# Altium schematic sheet 1_ZynTra-Power.SchDoc
size 381 x 355 mm; DocumentNumber: 1; SheetNumber: 1; SheetTotal: 10
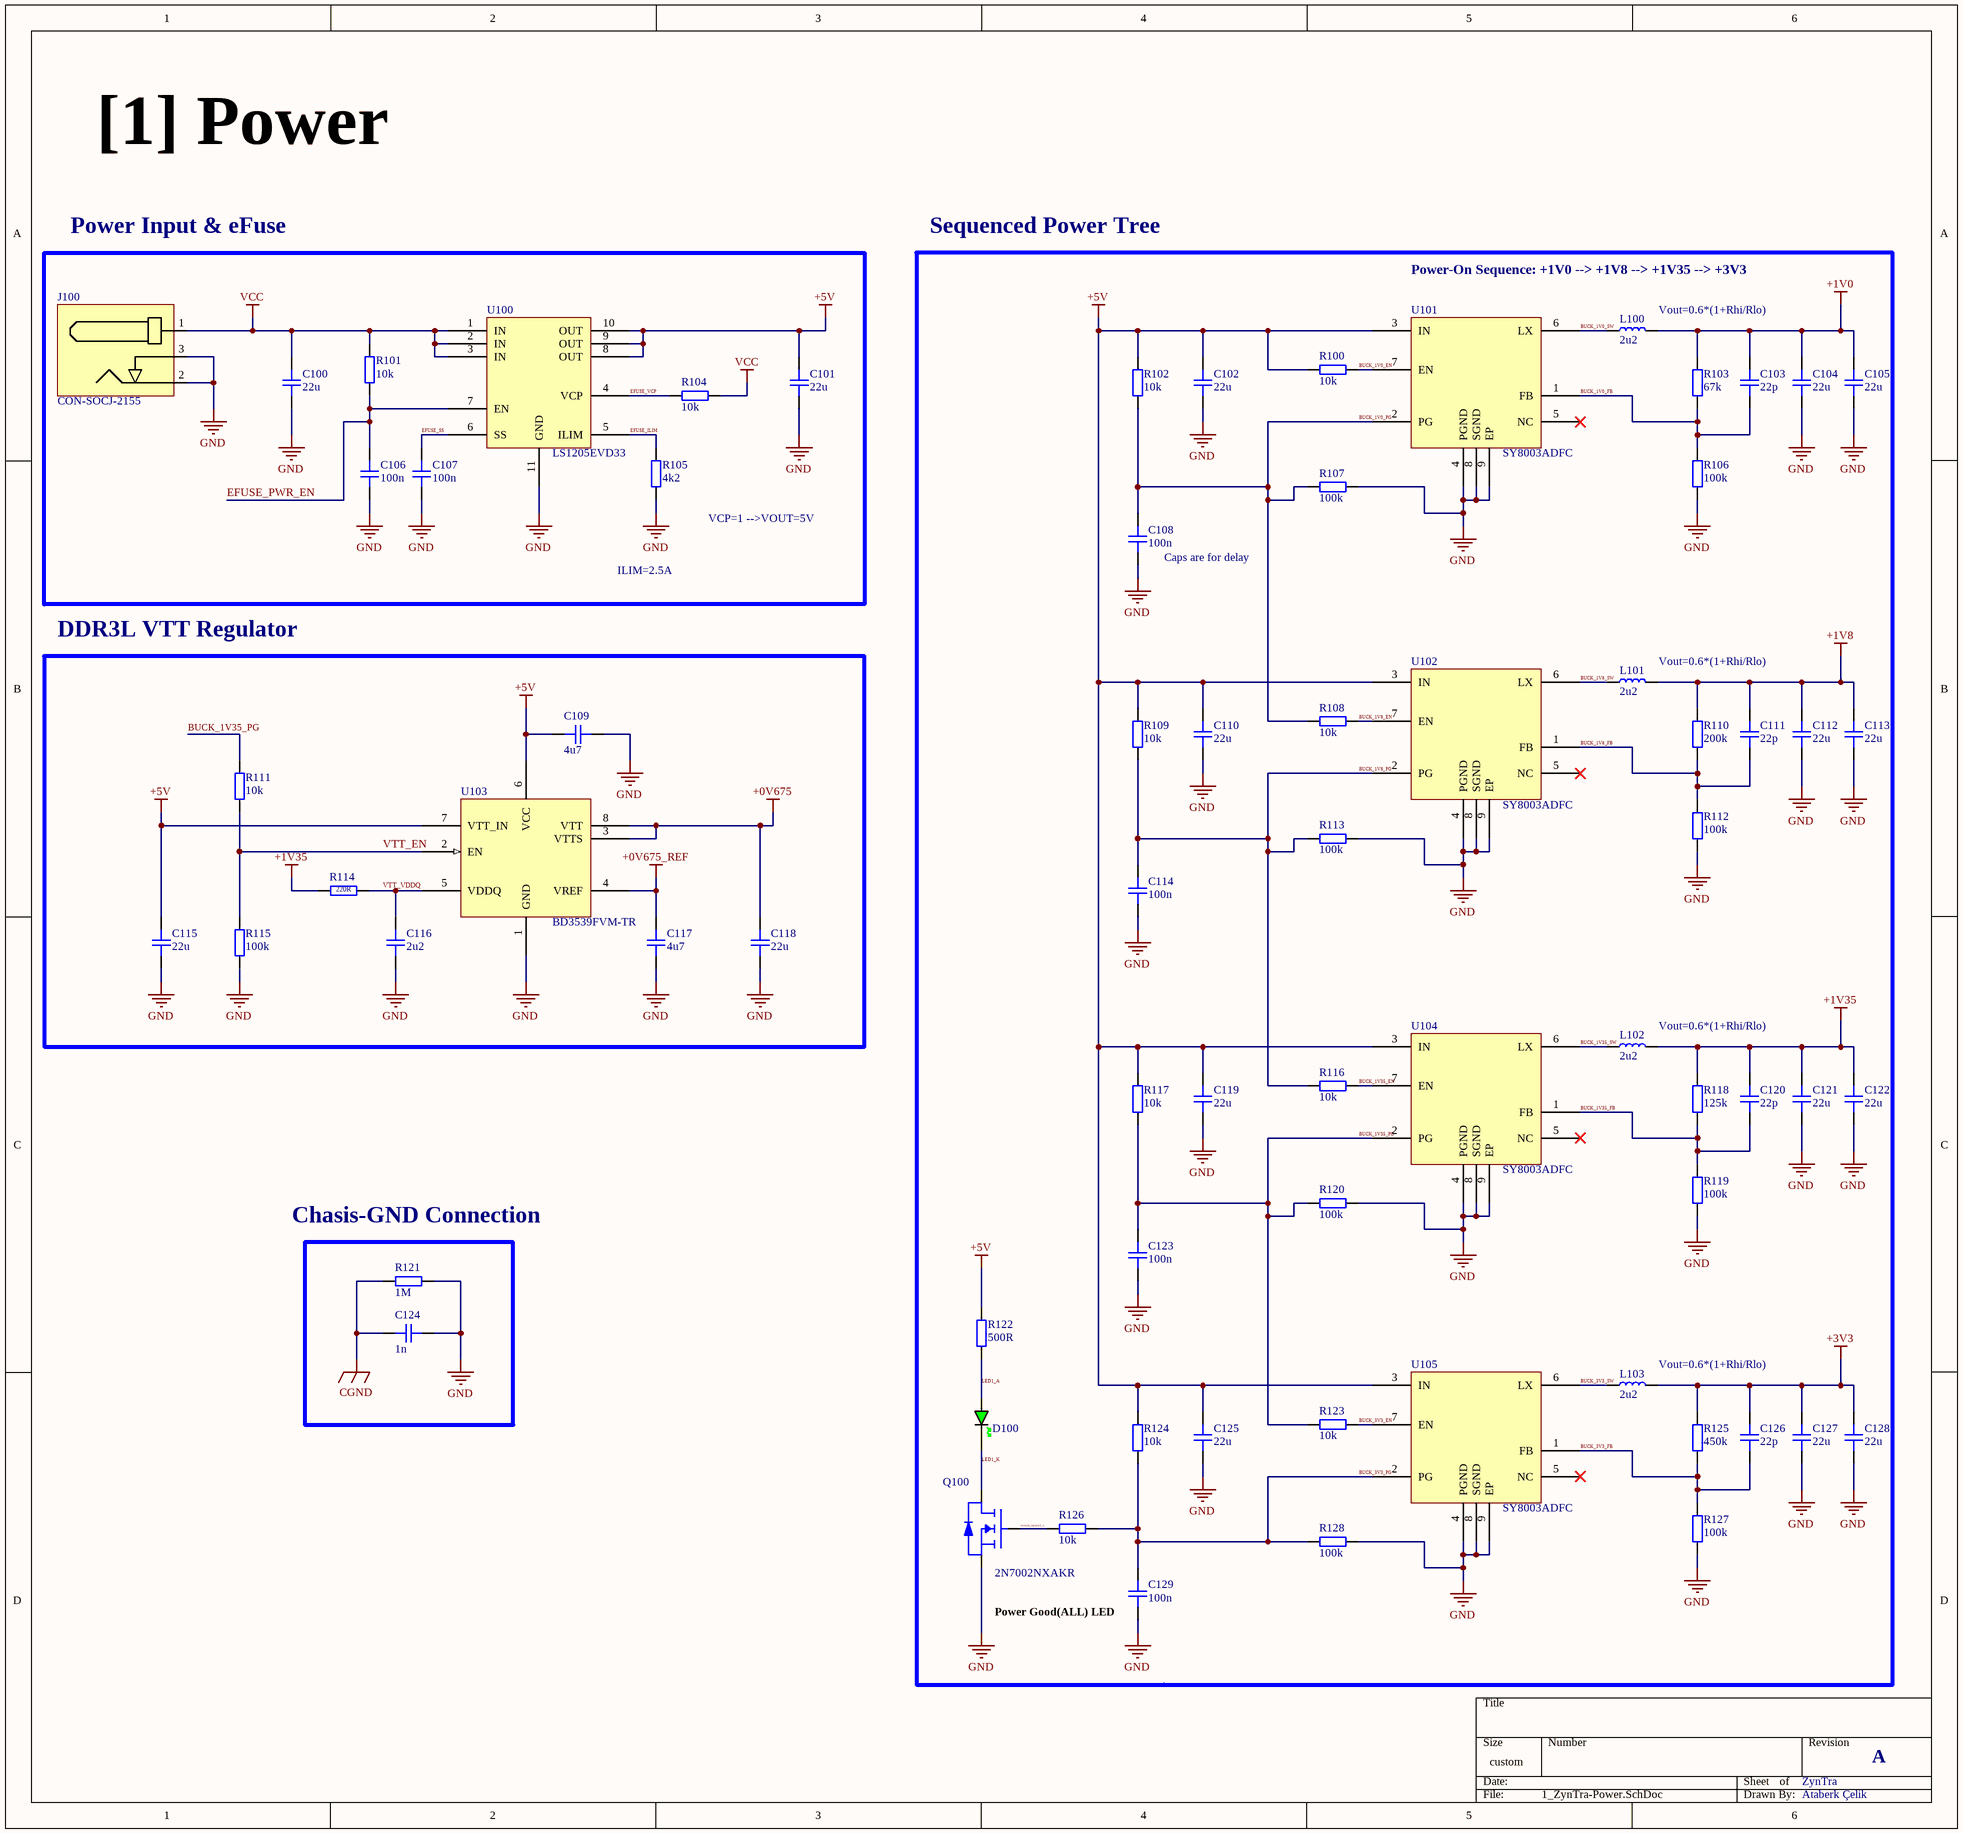
[diagram p0: 1_ZynTra-Power.SchDoc]

## Parts
C100  22u  [CAP_1206]
C101  22u  [CAP_1206]
C102  22u  [CAP_1206]
C103  22p  [CAP_0201]
C104  22u  [CAP_1206]
C105  22u  [CAP_1206]
C106  100n  [CAP_0402]
C107  100n  [CAP_0402]
C108  100n  [CAP_0402]
C109  4u7  [CAP_0402]
C110  22u  [CAP_1206]
C111  22p  [CAP_0201]
C112  22u  [CAP_1206]
C113  22u  [CAP_1206]
C114  100n  [CAP_0402]
C115  22u  [CAP_1206]
C116  2u2  [CAP_0402]
C117  4u7  [CAP_0402]
C118  22u  [CAP_1206]
C119  22u  [CAP_1206]
C120  22p  [CAP_0201]
C121  22u  [CAP_1206]
C122  22u  [CAP_1206]
C123  100n  [CAP_0402]
C124  1n  [CAP_1206]
C125  22u  [CAP_1206]
C126  22p  [CAP_0201]
C127  22u  [CAP_1206]
C128  22u  [CAP_1206]
C129  100n  [CAP_0402]
D100  GREEN  [LED_0603_GREEN]  (value not drawn)
J100  CON-SOCJ-2155  [CON-SOCJ-2155]
L100  2u2  [SRP0415]
L101  2u2  [SRP0415]
L102  2u2  [SRP0415]
L103  2u2  [SRP0415]
Q100  2N7002NXAKR  [SSM3J338R,LF-SOT23-F]
R100  10k  [RES_0402]
R101  10k  [RES_0402]
R102  10k  [RES_0402]
R103  67k  [RES_0402]
R104  10k  [RES_0402]
R105  4k2  [RES_0402]
R106  100k  [RES_0402]
R107  100k  [RES_0402]
R108  10k  [RES_0402]
R109  10k  [RES_0402]
R110  200k  [RES_0402]
R111  10k  [RES_0402]
R112  100k  [RES_0402]
R113  100k  [RES_0402]
R114  220R  [RES_0402]
R115  100k  [RES_0402]
R116  10k  [RES_0402]
R117  10k  [RES_0402]
R118  125k  [RES_0402]
R119  100k  [RES_0402]
R120  100k  [RES_0402]
R121  1M  [RES_1206]
R122  500R  [RES_0402]
R123  10k  [RES_0402]
R124  10k  [RES_0402]
R125  450k  [RES_0402]
R126  10k  [RES_0402]
R127  100k  [RES_0402]
R128  100k  [RES_0402]
U100  LS1205EVD33  [DFN3x3_10L]
U101  SY8003ADFC  [DFN2x2-8]
U102  SY8003ADFC  [DFN2x2-8]
U103  BD3539FVM-TR  [MSOP-8, 4x2.9mm]
U104  SY8003ADFC  [DFN2x2-8]
U105  SY8003ADFC  [DFN2x2-8]

## Blocks framed on the sheet
Power Input & eFuse: C100 C101 C106 C107 J100 R101 R104 R105 U100
Sequenced Power Tree: C102-C105 C108 C110-C114 C119-C123 C125-C129 D100 L100-L103 Q100 R100 R102 R103 R106-R110 R112 R113 R116-R120 R122-R128 U101 U102 U104 U105
DDR3L VTT Regulator: C109 C115-C118 R111 R114 R115 U103

## Nets
+0V675: C118.2 U103.3(VTTS) U103.8(VTT)
+0V675_REF: C117.2 U103.4(VREF)
+1V0: C103.2 C104.2 C105.2 L100.2 R103.1
+1V8: C111.2 C112.2 C113.2 L101.2 R110.1
+1V35: C120.2 C121.2 C122.2 L102.2 R114.2 R118.1
+3V3: C126.2 C127.2 C128.2 L103.2 R125.1
+5V: C101.2 C102.2 C109.2 C110.2 C115.2 C119.2 C125.2 R100.2 R102.1 R109.1 R117.1 R122.1 R124.1 U100.8(OUT) U100.9(OUT) U100.10(OUT) U101.3(IN) U102.3(IN) U103.6(VCC) U103.7(VTT_IN) U104.3(IN) U105.3(IN)
CGND: C124.1 R121.1
GND: C100.1 C101.1 C102.1 C104.1 C105.1 C106.1 C107.1 C108.1 C109.1 C110.1 C112.1 C113.1 C114.1 C115.1 C116.1 C117.1 C118.1 C119.1 C121.1 C122.1 C123.1 C124.2 C125.1 C127.1 C128.1 C129.1 J100.2 J100.3 Q100.S R105.1 R106.2 R107.2 R112.2 R113.2 R115.1 R119.2 R120.2 R121.2 R127.2 R128.2 U100.11(GND) U101.4(PGND) U101.8(SGND) U101.9(EP) U102.4(PGND) U102.8(SGND) U102.9(EP) U103.1(GND) U104.4(PGND) U104.8(SGND) U104.9(EP) U105.4(PGND) U105.8(SGND) U105.9(EP)
VCC: C100.2 J100.1 R101.2 R104.1 U100.1(IN) U100.2(IN) U100.3(IN)
BUCK_1V0_EN: R100.1 U101.7(EN)
BUCK_1V0_FB: C103.1 R103.2 R106.1 U101.1(FB)
BUCK_1V0_PG: C108.2 R102.2 R107.1 R108.2 U101.2(PG)
BUCK_1V0_SW: L100.1 U101.6(LX)
BUCK_1V8_EN: R108.1 U102.7(EN)
BUCK_1V8_FB: C111.1 R110.2 R112.1 U102.1(FB)
BUCK_1V8_PG: C114.2 R109.2 R113.1 R116.2 U102.2(PG)
BUCK_1V8_SW: L101.1 U102.6(LX)
BUCK_1V35_EN: R116.1 U104.7(EN)
BUCK_1V35_FB: C120.1 R118.2 R119.1 U104.1(FB)
BUCK_1V35_PG: C123.2 R111.1 R117.2 R120.1 R123.2 U104.2(PG)
BUCK_1V35_SW: L102.1 U104.6(LX)
BUCK_3V3_EN: R123.1 U105.7(EN)
BUCK_3V3_FB: C126.1 R125.2 R127.1 U105.1(FB)
BUCK_3V3_PG: C129.2 R124.2 R126.2 R128.1 U105.2(PG)
BUCK_3V3_SW: L103.1 U105.6(LX)
EFUSE_ILIM: R105.2 U100.5(ILIM)
EFUSE_PWR_EN: C106.2 R101.1 U100.7(EN)
EFUSE_SS: C107.2 U100.6(SS)
EFUSE_VCP: R104.2 U100.4(VCP)
LED1_A: D100.A R122.2
LED1_K: D100.K Q100.D
POWER_MOSFET_G: Q100.G R126.1
VTT_EN: R111.2 R115.2 U103.2(EN)
VTT_VDDQ: C116.2 R114.1 U103.5(VDDQ)

Not connected (* = marked no-connect by the designer): U101 5(NC)*; U102 5(NC)*; U104 5(NC)*; U105 5(NC)*

## Notes on the sheet
- [1] Power
- Power-On Sequence: +1V0 --> +1V8 --> +1V35 --> +3V3
- (near L100) Vout=0.6*(1+Rhi/Rlo)
- VCP=1 -->VOUT=5V
- ILIM=2.5A
- (near C108) Caps are for delay
- (near L101) Vout=0.6*(1+Rhi/Rlo)
- (near L102) Vout=0.6*(1+Rhi/Rlo)
- Chasis-GND Connection
- (near L103) Vout=0.6*(1+Rhi/Rlo)
- (near C129) Power Good(ALL) LED
- ZynTra
- A
- Ataberk Çelik

## Library data of the parts
C100-C102 C104 C105 C110 C112 C113 C115 C118 C119 C121 C122 C124 C125 C127 C128 = CAP_1206: Capacitor SMD 1206; Manufacturer: *; Manufacturer Part Number: *; Distributor Link: *; LCSC: *; Rating: *; Dielectric: *
C103 C111 C120 C126 = CAP_0201: Capacitor SMD 0201; Manufacturer: *; Manufacturer Part Number: *; Distributor Link: *; LCSC: *; Rating: *; Dielectric: *
C106-C109 C114 C116 C117 C123 C129 = CAP_0402: Capacitor SMD 0402; Manufacturer: *; Manufacturer Part Number: *; Distributor Link: *; LCSC: *; Rating: *; Dielectric: *
D100 = LED_0603_GREEN: LED 0603 GREEN SMD
J100 = CON-SOCJ-2155: DC Barrell Jack 2.1mm 30V 2.5A THT; Manufacturer: Gravitech; Manufacturer Part Number: CON-SOCJ-2155
L100-L103 = SRP0415-2R2K: Inductor SMD 2.2uH Bourns SRP0415-2R2K; Manufacturer: Bourns; Manufacturer Part Number: SRP0415-2R2K
Q100 = 2N7002NXAKR: MOSFET N-Channel Vds=60V Id=300mA with ESD Protection; Manufacturer: Nexperia; Manufacturer Part Number: 2N7002NXAKR
R100-R120 R122-R128 = RES_0402: Resistor SMD 0402; Manufacturer: *; Manufacturer Part Number: *; Distributor Link: *; LCSC: *
R121 = RES_1206: Resistor SMD 1206; Manufacturer: *; Manufacturer Part Number: *; Distributor Link: *; LCSC: *
U100 = LS1205EVD33: 18V, 5A eFuse with Programmable Current Limit and Output Voltage Clamp; Manufacturer: Littelfuse; Manufacturer Part Number: LS1205EVD33; Supplier Link: https://www.mouser.com.tr/ProductDetail/Littelfuse/LS1205EVD33?qs=4ASt3YYao0VRtislHe5uQQ%3D%3D
U101 U102 U104 U105 = SY8003ADFC: High Efficiency 5.5V, 3A continuous, 1MHz / Synchronous Step Down Regulator; Manufacturer: Silergy; Manufacturer Part Number: SY8003ADFC; Supplier Link: https://www.lcsc.com/product-detail/C178236.html
U103 = BD3539FVM-TR: 1.0V to 5.5V, 1A 1ch / Termination Regulators for DDR-SDRAMs; Manufacturer: ROHM Semiconductor; Manufacturer Part Number: BD3539FVM-TR; Supplier Link: https://www.mouser.com.tr/ProductDetail/ROHM-Semiconductor/BD3539FVM-TR?qs=IsRgwgmxh6%252BQFw%252BWQZBMCg%3D%3D